# Altium schematic sheet SA818S.SchDoc
size A4; DocumentNumber: 3; SheetNumber: 3; SheetTotal: 7
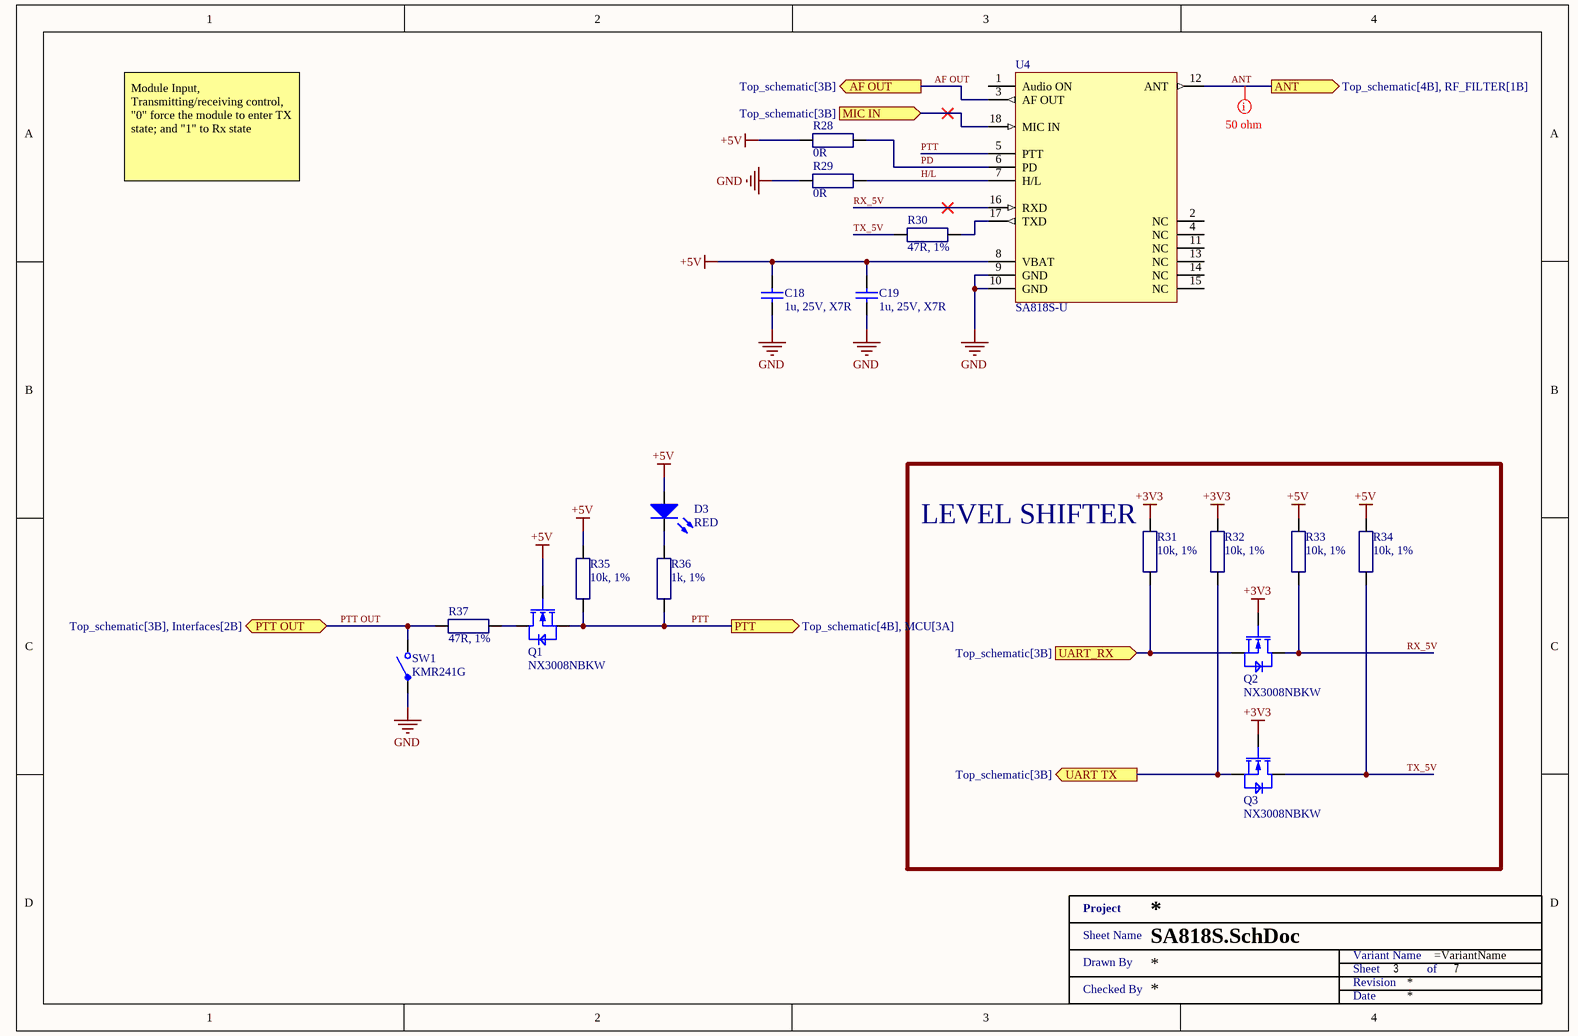
[diagram p0: SA818S.SchDoc]

## Parts
C18  1u, 25V, X7R  [SMD0603]
C19  1u, 25V, X7R  [SMD0603]
D3  RED  [MCL-S270]
Q1  NX3008NBKW  [SOT323]
Q2  NX3008NBKW  [SOT323]
Q3  NX3008NBKW  [SOT323]
R28  0R  [SMD0603 - R]
R29  0R  [SMD0603 - R]
R30  47R, 1%  [SMD0603 - R]
R31  10k, 1%  [SMD0603 - R]
R32  10k, 1%  [SMD0603 - R]
R33  10k, 1%  [SMD0603 - R]
R34  10k, 1%  [SMD0603 - R]
R35  10k, 1%  [SMD0603 - R]
R36  1k, 1%  [SMD0603 - R]
R37  47R, 1%  [SMD0603 - R]
SW1  KMR241G  [KMR2]
U4  SA818S-U  [SA818S]
XX?  Title 1  (value not drawn)  (graphical)

## Blocks framed on the sheet
LEVEL SHIFTER: Q2 Q3 R31-R34

## Ports
AF OUT (out, see Top_schematic[3B]), ANT (out, see Top_schematic[4B], RF_FILTER[1B]), MIC IN (in, see Top_schematic[3B]), PTT (out, see Top_schematic[4B], MCU[3A]), PTT OUT (bidir, see Top_schematic[3B], Interfaces[2B]), UART TX (out, see Top_schematic[3B]), UART_RX (in, see Top_schematic[3B])

## Nets
+3V3: Q2.1(G) Q3.1(G) R31.1 R32.1
+5V: C18.2 C19.2 D3.2(A) Q1.1(G) R28.1 R33.1 R34.1 R35.1 U4.8(VBAT)
GND: C18.1 C19.1 R29.1 SW1.1 U4.9(GND) U4.10(GND)
AF OUT: U4.3(AF_OUT) ; port AF OUT
ANT: U4.12(ANT) ; port ANT
H/L: R29.2 U4.7(H/L)
MIC IN: U4.18(MIC_IN) ; port MIC IN
PD: R28.2 U4.6(PD)
PTT: Q1.2(S) R35.2 R36.1 U4.5(PTT) ; port PTT
PTT OUT: R37.2 SW1.2 ; port PTT OUT
RX_5V: Q2.3(D) R33.2 U4.16(RXD)
TX_5V: Q3.3(D) R30.1 R34.2
UART TX: Q3.2(S) R32.2 ; port UART TX
UART_RX: Q2.2(S) R31.2 ; port UART_RX
NetD3_1: D3.1(K) R36.2
NetQ1_3: Q1.3(D) R37.1
NetR30_2: R30.2 U4.17(TXD)

Not connected (* = marked no-connect by the designer): U4 1(Audio_ON) 2(NC) 4(NC) 11(NC) 13(NC) 14(NC) 15(NC)

## Layout directives
net class 50 ohm: ANT

## Notes on the sheet
- Module Input, Transmitting/receiving control, "0" force the module to enter TX state; and "1" to Rx state
- (in symbol Title 1) Project; Sheet Name; Variant Name; Drawn By; Sheet; of; Revision; Checked By; Date

## Library data of the parts
C18 C19 = CGA3E1X7R1E105K080AC: CAP CER 1UF 25V X7R 0603; Manufacturer: TDK Corporation; Tolerance: ±10%; Manufacturer Part Number: CGA3E1X7R1E105K080AC; RoHS: RoHS Compliant; Category: Capacitors; Stock 1: 109509; Pricing 1: 1=0.2, 10=0.135, 100=0.0686, 500=0.04696, 1000=0.04154 (USD); Packaging: Cut Tape (CT); Part Status: Active; Voltage - Rated: 25V; Temperature Coefficient: X7R; Operating Temperature: -55°C ~ 125°C; Features: -; Ratings: AEC-Q200; Applications: Automotive; Failure Rate: -; Mounting Type: Surface Mount, MLCC; Package / Case: 0603 (1608 Metric); Size / Dimension: 0.063" L x 0.032" W (1.60mm x 0.80mm); Height - Seated (Max): -; Thickness (Max): 0.035" (0.90mm); Lead Spacing: -; Lead Style: -; ComponentLink1URL: https://product.tdk.com/info/en/catalog/datasheets/mlcc_automotive_general_en.pdf; ComponentLink1Description: https://product.tdk.com/info/en/catalog/datasheets/mlcc_automotive_general_en.pdf; Capacitance: 1u; Supplier 1: Mouser; Supplier Part Number 1: 810-CGA3E1X7R1E105K; Supplier 2: Farnell; Supplier Part Number 2: 2346962; Supplier 3: Digi-Key; Supplier Part Number 3: 445-6931-1-ND
D3 = MCL-S270SRC: MULTICOMP - MCL-S270SRC - LED, SMD, 0805, SUPER-RED; Bulb Size: 1.25mm x 1.4; Forward Current If: 20; Forward Voltage: 1.85; Wavelength Typ: 643; Luminous Intensity: 17; Viewing Angle: 140°; Lens Shape: Rectangular; SVHC: No SVHC (17-Dec-2015); Forward Voltage VF Max: 2.4; LED / Lamp Size: 1.4mm x 1.25; LED Type: Standard; Luminous Intensity Min: 14; No. of Pins: 2; Peak Forward Current: 120; Peak Wavelength: 660; Power Dissipation Pd: 100; Reverse Protection Voltage: 5; Voltage Vf Min: 1.5; Voltage Vf Typ: 1.85V<!--FANDB--><div class="features-and-benefits-container"><div class="features-and-benefits-description"><span class="features-benefits-value">The MCL-S270SRC is a super red SMD LED with water clear epoxy, made of GaAlAs dice.</span></div><div class="features-and-benefits-list"><ul class="features-and-benefits-list-list"><li class="features-and-benefits-list-item">0805 Case</li><li class="features-and-benefits-list-item">5V Reverse voltage</li><li class="features-and-benefits-list-item">10?A at 5V Reverse current</li><li class="features-and-benefits-list-item">-40 to 85; Manufacturer: MULTICOMP; Manufacturer Part Number: MCL-S270SRC; RoHS: YES; Stock 1: 27404; Pricing 1: 5=0,154, 25=0,142, 100=0,132, 250=0,0847, 500=0,0679, 2000=0,0583, 5000=0,0521, 20000=0,0455 (GBP); LED Colour: Red; LED Mounting: SMD; Packaging: Cut Tape; Product Range: -; Automotive Qualification Standard: -; MSL: MSL 3 - 168 hours; Current Rating: 20; Dominant Wavelength: 643; Dominant Wavelength Typ: 643; Forward Current If Max: 20; Luminous Intensity Max: 20; Luminous Intensity Typ: 17; Operating Temperature Max: 85; Operating Temperature Min: -40; Operating Temperature Range: -40°C to +85; Storage Temperature Max: +100; Storage Temperature Min: -40; ComponentLink1URL: http://www.farnell.com/cad/53023.pdf; ComponentLink1Description: http://www.farnell.com/cad/53023.pdf; ComponentLink2URL: http://www.farnell.com/datasheets/2182724.pdf; ComponentLink2Description: http://www.farnell.com/datasheets/2182724.pdf; Supplier 1: Farnell; Supplier Part Number 1: 1581239; Supplier 2: Newark; Supplier Part Number 2: 14N9358
Q1-Q3 = NX3008NBKW: NXP - NX3008NBKW - MOSFET, N CH, 30V, 350MA, SOT323; Transistor Polarity: N Channel; Continuous Drain Current Id: 350; Drain Source Voltage Vds: 30; On Resistance Rds(on): 1; Rds(on) Test Voltage Vgs: 4.5; Threshold Voltage Vgs: 900; Power Dissipation Pd: 260; Transistor Case Style: SOT-323; No. of Pins: 3; SVHC: No SVHC (17-Dec-2015); Pulse Current Idm: -0.8; Voltage Vgs th Max: 8; Manufacturer: NXP; Manufacturer Part Number: NX3008NBKW; RoHS: YES; Stock 1: 4764; Pricing 1: 1=0.0425, 25=0.0385, 100=0.0347, 250=0.0334, 500=0.0312, 2000=0.0291, 4000=0.0282, 20000=0.0273 (GBP); Operating Temperature Max: 150; Product Range: -; Automotive Qualification Standard: -; MSL: MSL 1 - Unlimited; Operating Temperature Min: -55; Operating Temperature Range: -55°C to +150; ComponentLink1URL: http://www.farnell.com/datasheets/1508392.pdf; ComponentLink1Description: http://www.farnell.com/datasheets/1508392.pdf; Supplier 1: Mouser; Supplier Part Number 1: 771-NX3008NBKW,115; Supplier 2: Farnell; Supplier Part Number 2: 2069546; Supplier 3: Arrow; Supplier Part Number 3: NX3008NBKW,115
R28 R29 = CRCW06030000Z0EA: RES SMD 0 OHM JUMPER 1/10W 0603; Manufacturer: Vishay Dale; Power (Watts): 0.1W, 1/10W; Manufacturer Part Number: CRCW06030000Z0EA; RoHS: RoHS Compliant; Category: Resistors; Stock 1: 0; Pricing 1: 1=0.1, 10=0.028, 25=0.0204, 50=0.0154, 100=0.0114, 250=0.00868, 500=0.00694, 1000=0.00511 (USD); Packaging: Cut Tape (CT); Part Status: Active; Tolerance: Jumper; Composition: Thick Film; Features: Automotive AEC-Q200; Temperature Coefficient: -; Operating Temperature: -55°C ~ 155°C; Package / Case: 0603 (1608 Metric); Supplier Device Package: 0603; Size / Dimension: 0.063" L x 0.033" W (1.60mm x 0.85mm); Height - Seated (Max): 0.020" (0.50mm); Failure Rate: -; ComponentLink1URL: http://www.vishay.com/docs/20035/dcrcwe3.pdf; ComponentLink1Description: http://www.vishay.com/docs/20035/dcrcwe3.pdf; Resistance: 0R; Supplier 1: Mouser; Supplier Part Number 1: 71-CRCW0603-0-E3; Supplier 2: Farnell; Supplier Part Number 2: 1469739; Supplier 3: Digi-Key; Supplier Part Number 3: 541-0.0GCT-ND
R30 R37 = RC0603FR-0747RL: YAGEO - RC0603FR-0747RL - Surface Mount Chip Resistor, Thick Film, RC Series, 47 ohm, 100 mW, 1%, 50 V, 0603 [1608 Metric] RoHS Compliant: Yes; Power Rating: 100mW; Voltage Rating (DC): 50V; Temperature Coefficient: 100ppm/°C; Voltage Rating: 75V; Supplier 1: Mouser; Supplier Part Number 1: 603-RC0603FR-0747RL; Manufacturer: Yageo; Manufacturer Part Number: RC0603FR-0747RL; RoHS: Yes; Category: Chip SMD Resistors; Stock 1: 314282; Pricing 1: 1=0.10000, 10=0.01800, 100=0.00600, 1000=0.00500, 5000=0.00300, 10000=0.00300 (USD); Case/Package: 0603; Number of Pins: 2; Weight: 7.1E-05oz; Case Code (Imperial): 0603; Case Code (Metric): 1608; Min Operating Temperature: -55°C; Max Operating Temperature: 155°C; Resistance: 47R; Tolerance: 1%; Packaging: Tape and Reel; Package Quantity: 1; Termination: SMD/SMT; Resistor Type: Thick Film; Number of Terminations: 2; Max Power Dissipation: 100mW; Features: Moisture Resistant; Length: 1.6mm; Height: 0.45mm; Width: 0.8mm; Depth: 0.8mm; REACH SVHC: Unknown; Lead Free: Lead Free; Military Standard: Not; ComponentLink1URL: https://datasheet.ciiva.com/2453/pyu-r-int-thick-7-2453922.pdf?src-supplier=Digi-Key; ComponentLink1Description: https://datasheet.ciiva.com/2453/pyu-r-int-thick-7-2453922.pdf?src-supplier=Digi-Key; ComponentLink2URL: https://datasheet.ciiva.com/2453/pyu-r-int-thick-7-2453923.pdf?src-supplier=Digi-Key; ComponentLink2Description: https://datasheet.ciiva.com/2453/pyu-r-int-thick-7-2453923.pdf?src-supplier=Digi-Key; ComponentLink3URL: https://datasheet.ciiva.com/2453/pyu-r-int-thick-7-2453924.pdf?src-supplier=Digi-Key; ComponentLink3Description: https://datasheet.ciiva.com/2453/pyu-r-int-thick-7-2453924.pdf?src-supplier=Digi-Key; ComponentLink4URL: https://datasheet.ciiva.com/7746/443971-7746363.pdf?src-supplier=Element14; ComponentLink4Description: https://datasheet.ciiva.com/7746/443971-7746363.pdf?src-supplier=Element14; ComponentLink5URL: https://datasheet.ciiva.com/7746/443971-7746364.pdf?src-supplier=Element14; ComponentLink5Description: https://datasheet.ciiva.com/7746/443971-7746364.pdf?src-supplier=Element14; ComponentLink6URL: https://datasheet.ciiva.com/46440/1868787-46440908.pdf?src-supplier=Element14; ComponentLink6Description: https://datasheet.ciiva.com/46440/1868787-46440908.pdf?src-supplier=Element14; Supplier 2: Farnell; Supplier Part Number 2: 9238328; Supplier 3: Digi-Key; Supplier Part Number 3: 311-47.0HRCT-ND
R31-R35 = RC0603FR-0710KL: YAGEO (PHYCOMP) - RC0603FR-0710KL - RES, THICK FILM, 10K, 1%, 0.1W, 0603; Voltage Rating: 50; Resistor Case Style: 0603 [1608 Metric]; Power Rating: 100; Product Range: RC Series; Temperature Coefficient: ± 100; SVHC: No SVHC (20-Jun-2016); Manufacturer: YAGEO (PHYCOMP); Manufacturer Part Number: RC0603FR-0710KL; RoHS: YES; Stock 1: 9995; Pricing 1: 5000=0.0025, 25000=0.0014, 50000=0.0013 (GBP); Resistance: 10k; Resistance Tolerance: ± 1%; Packaging: Tape & Reel; Resistor Element Material: Thick Film; Automotive Qualification Standard: -; MSL: MSL 1 - Unlimited<!--FANDB--><div class="features-and-benefits-container"><div class="features-and-benefits-desc-container"><span class="features-and-benefits-container-desc">SMD Chip Resistor, Thick Film, 10 kohm, 50 V, 0603 [1608 Metric], 100 mW, ± 1; ComponentLink1URL: http://past.yageo.com/pdf/PYu-R_Packing_6.pdf; ComponentLink1Description: http://past.yageo.com/pdf/PYu-R_Packing_6.pdf; ComponentLink2URL: http://www.farnell.com/datasheets/2167052.pdf; ComponentLink2Description: http://www.farnell.com/datasheets/2167052.pdf; Supplier 1: Mouser; Supplier Part Number 1: 603-RC0603FR-0710KL; Supplier 2: Farnell; Supplier Part Number 2: 2421850; Supplier 3: Digi-Key; Supplier Part Number 3: 311-10.0KHRCT-ND
R36 = MCWR06X1001FTL: MULTICOMP - MCWR06X1001FTL - RES, THICK FILM, 1K, 1%, 0.1W, 0603; Voltage Rating: 50; Resistor Case Style: 0603 [1608 Metric]; Power Rating: 100; Product Range: MCWR Series; Temperature Coefficient: ± 100; SVHC: No SVHC (07-Jul-2017)<!--FANDB--><div class="features-and-benefits-container"><div class="features-and-benefits-desc-container"><span class="features-and-benefits-container-desc">SMD Chip Resistor, Thick Film, 1 kohm, 50 V, 0603 [1608 Metric], 100 mW, ± 1; Manufacturer: MULTICOMP; Manufacturer Part Number: MCWR06X1001FTL; RoHS: Y-EX; Stock 1: 134740; Pricing 1: 10=0.0037, 100=0.0022, 500=0.0016, 1000=0.0012, 2500=0.001 (GBP); Resistance: 1k; Resistance Tolerance: ± 1%; Packaging: Cut Tape; Resistor Element Material: Thick Film; Automotive Qualification Standard: -; ComponentLink1URL: http://www.farnell.com/datasheets/1849611.pdf; ComponentLink1Description: http://www.farnell.com/datasheets/1849611.pdf; Supplier 1: Farnell; Supplier Part Number 1: 2447272; Supplier 2: Newark; Supplier Part Number 2: 94X1378
SW1 = KMR241G LFS: C & K COMPONENTS - KMR241G LFS - SWITCH, SMD, 4N, 0.05A, 32VDC, SPST-NO; Illumination: Non Illuminated; Contact Voltage DC Nom: 32; Contact Current Max: 50; Operating Force: 4; Switch Terminals: Solder; SVHC: No SVHC (17-Dec-2015); Actuation Type: Top; Actuator / Cap Colour: Black; Contact Resistance: 100; External Depth: 2.8; External Length / Height: 1.9; External Width: 4.6; Power Rating: 1VA<!--FANDB--><div class="features-and-benefits-container"><div class="features-and-benefits-description"><span class="features-benefits-value">The KMR241G LFS is a micro-miniature SMD Tactile Switch with momentary action and SPST-NO contact arrangement. It has silver-plated gull-wing terminals and grounding pin.</span></div><div class="features-and-benefits-list"><ul class="features-and-benefits-list-list"><li class="features-and-benefits-list-item">Top actuated</li><li class="features-and-benefits-list-item">Excellent tactile feel</li><li class="features-and-benefits-list-item">Ultra low current capabilities</li><li class="features-and-benefits-list-item">300000-cycle Operating life</li><li class="features-and-benefits-list-item">IP40 Protection rating</li></ul></div><div class="features-and-benefits-applications"><ul class="features-and-benefits-value"><li class="features-and-benefits-list-item">Automotive</li><li class="features-and-benefits-list-item">Industrial</li><li class="features-and-benefits-list-item">Medical</li><li class="features-and-benefits-list-item">Portable Devices</li></ul></div></div>; Manufacturer: C & K COMPONENTS; Manufacturer Part Number: KMR241G LFS; RoHS: YES; Stock 1: 40256; Pricing 1: 1=0.384, 50=0.37, 100=0.218, 7000=0.185, 20000=0.181, 30000=0.178, 50000=0.174 (GBP); Product Range: -; Contact Configuration: SPST-NO; Operating Temperature Max: 85; Operating Temperature Min: -40; ComponentLink1URL: http://www.farnell.com/datasheets/1702857.pdf; ComponentLink1Description: http://www.farnell.com/datasheets/1702857.pdf; Supplier 1: Mouser; Supplier Part Number 1: 611-KMR241GLFS; Supplier 2: Farnell; Supplier Part Number 2: 1437637; Supplier 3: Digi-Key; Supplier Part Number 3: CKN10248DKR-ND
U4 = SA818S-U: 1W Embedded small size walkie talkie module